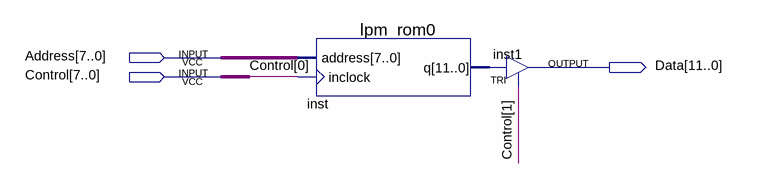
[diagram p0: schematic sheet]
// Quartus schematic rom.bdf as structural Verilog: 2 symbols, 3 pins
module rom (
  input  [7:0] Address,
  input  [7:0] Control,
  output [11:0] Data
);

  wire [11:0] inst_q;

  lpm_rom0 inst (.address(Address), .inclock(Control[0]), .q(inst_q));
  TRI inst1[11:0] (.IN(inst_q), .OE(Control[1]), .OUT(Data));
endmodule
